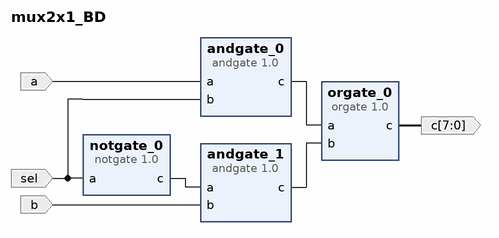
[diagram p0: block diagram of the top level]
# Vivado block design mux2x1_BD, Vivado 2015.2
create_bd_design mux2x1_BD

create_bd_port -dir I a
create_bd_port -dir I b
create_bd_port -dir I sel
create_bd_port -dir O -from 7 -to 0 c

create_bd_cell -type ip -vlnv xilinx.com:user:andgate:1.0 andgate_0
create_bd_cell -type ip -vlnv xilinx.com:user:andgate:1.0 andgate_1
create_bd_cell -type ip -vlnv xilinx.com:user:orgate:1.0 orgate_0
create_bd_cell -type ip -vlnv xilinx.com:user:notgate:1.0 notgate_0

# ---- connections ----

connect_bd_net [get_bd_pins orgate_0/c] [get_bd_ports c]
connect_bd_net [get_bd_ports a] [get_bd_pins andgate_0/a]
connect_bd_net [get_bd_ports sel] [get_bd_pins andgate_0/b] [get_bd_pins notgate_0/a]
connect_bd_net [get_bd_pins notgate_0/c] [get_bd_pins andgate_1/a]
connect_bd_net [get_bd_ports b] [get_bd_pins andgate_1/b]
connect_bd_net [get_bd_pins andgate_0/c] [get_bd_pins orgate_0/a]
connect_bd_net [get_bd_pins andgate_1/c] [get_bd_pins orgate_0/b]

validate_bd_design
save_bd_design
